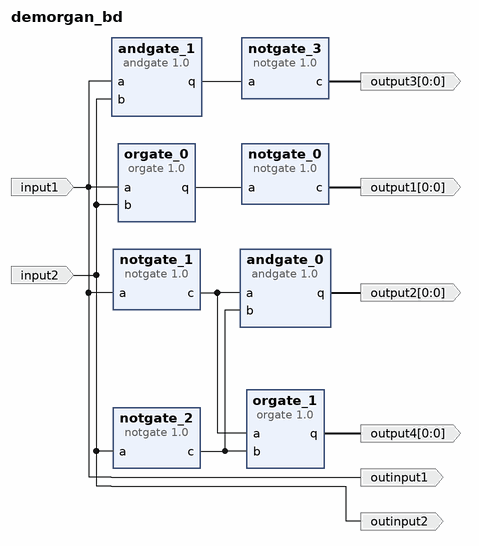
[diagram p0: block diagram of the top level]
# Vivado block design demorgan_bd, xc7a100tfgg484-1, Vivado 2017.4
create_bd_design demorgan_bd

create_bd_port -dir I input1
create_bd_port -dir I input2
create_bd_port -dir O outinput1
create_bd_port -dir O outinput2
create_bd_port -dir O -from 0 -to 0 output1
create_bd_port -dir O -from 0 -to 0 output2
create_bd_port -dir O -from 0 -to 0 output3
create_bd_port -dir O -from 0 -to 0 output4

create_bd_cell -type ip -vlnv SUSTC:CSE:notgate:1.0 notgate_0
create_bd_cell -type ip -vlnv SUSTC:CSE:orgate:1.0 orgate_0
create_bd_cell -type ip -vlnv SUSTC:CSE:notgate:1.0 notgate_1
create_bd_cell -type ip -vlnv SUSTC:CSE:notgate:1.0 notgate_2
create_bd_cell -type ip -vlnv SUSTC:CSE:andgate:1.0 andgate_0
create_bd_cell -type ip -vlnv SUSTC:CSE:andgate:1.0 andgate_1
create_bd_cell -type ip -vlnv SUSTC:CSE:notgate:1.0 notgate_3
create_bd_cell -type ip -vlnv SUSTC:CSE:orgate:1.0 orgate_1

# ---- connections ----

connect_bd_net -net input1_1 [get_bd_ports input1] \
  [get_bd_ports outinput1] [get_bd_pins orgate_0/a] [get_bd_pins notgate_1/a] [get_bd_pins andgate_1/a]
connect_bd_net -net input2_1 [get_bd_ports input2] \
  [get_bd_ports outinput2] [get_bd_pins orgate_0/b] [get_bd_pins notgate_2/a] [get_bd_pins andgate_1/b]
connect_bd_net [get_bd_pins notgate_0/c] [get_bd_ports output1]
connect_bd_net [get_bd_pins orgate_0/q] [get_bd_pins notgate_0/a]
connect_bd_net [get_bd_pins notgate_1/c] [get_bd_pins andgate_0/a] [get_bd_pins orgate_1/a]
connect_bd_net [get_bd_pins notgate_2/c] [get_bd_pins andgate_0/b] [get_bd_pins orgate_1/b]
connect_bd_net [get_bd_pins andgate_0/q] [get_bd_ports output2]
connect_bd_net [get_bd_pins andgate_1/q] [get_bd_pins notgate_3/a]
connect_bd_net [get_bd_pins notgate_3/c] [get_bd_ports output3]
connect_bd_net [get_bd_pins orgate_1/q] [get_bd_ports output4]

validate_bd_design
save_bd_design
